# EAGLE design UIPCB (EAGLE 9.5.1)
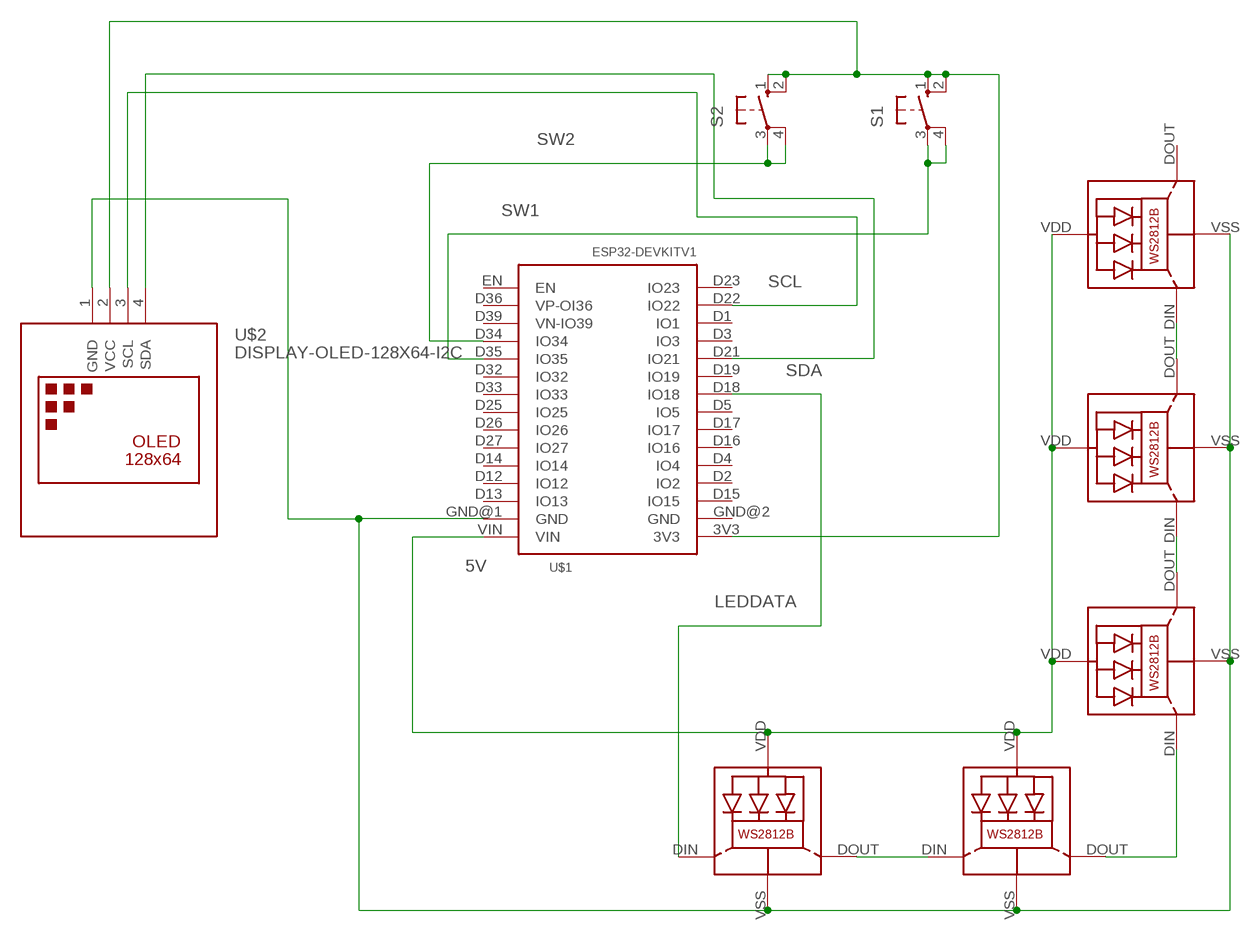
[diagram p0: schematic, sheet 1]

## Parts
LED0  WS2812B  [WS2812B]
LED1  WS2812B  [WS2812B]
LED2  WS2812B  [WS2812B]
LED3  WS2812B  [WS2812B]
LED4  WS2812B  [WS2812B]
S1  10-XX  [B3F-10XX]
S2  10-XX  [B3F-10XX]
U$1  ESP32DEVKITV1  [ESP32-DEVKITV1]
U$2  DISPLAY-OLED-128X64-I2C  [DISPLAY-OLED-128X64-I2C]

## Nets
3V3: S1.1(S) S1.2(S1) S2.1(S) S2.2(S1) U$1.3V3 U$2.2(VCC)
5V: LED0.VDD LED1.VDD LED2.VDD LED3.VDD LED4.VDD U$1.VIN
GND: LED0.VSS(GND) LED1.VSS(GND) LED2.VSS(GND) LED3.VSS(GND) LED4.VSS(GND) U$1.GND@1(GND) U$2.1(GND)
LEDDATA: LED0.DIN(DI) U$1.D18(IO18)
N$1: LED0.DOUT(DO) LED1.DIN(DI)
N$2: LED1.DOUT(DO) LED2.DIN(DI)
N$3: LED2.DOUT(DO) LED3.DIN(DI)
N$4: LED3.DOUT(DO) LED4.DIN(DI)
SCL: U$1.D22(IO22) U$2.3(SCL)
SDA: U$1.D21(IO21) U$2.4(SDA)
SW1: S1.3(P) S1.4(P1) U$1.D35(IO35)
SW2: S2.3(P) S2.4(P1) U$1.D34(IO34)
Unconnected: LED4.DOUT(DO) U$1.D1(IO1) U$1.D2(IO2) U$1.D3(IO3) U$1.D4(IO4) U$1.D5(IO5) U$1.D12(IO12) U$1.D13(IO13) U$1.D14(IO14) U$1.D15(IO15) U$1.D16(IO16) U$1.D17(IO17) U$1.D19(IO19) U$1.D23(IO23) U$1.D25(IO25) U$1.D26(IO26) U$1.D27(IO27) U$1.D32(IO32) U$1.D33(IO33) U$1.D36(VP-OI36) U$1.D39(VN-IO39) U$1.EN U$1.GND@2(GND)

## Library data of the parts
LED0 LED1-LED4 = WS2812B:WS2812B: Features and Benefits  * Intelligent reverse connect protection, the power supply reverse connection does not damage the IC. * The control circuit and the LED share the only power source. Control circuit and RGB chip are integrated in a package of 5050 components, form a complete control of pixel point.  * Built-in signal reshaping circuit, after wave reshaping to the next driver, ensure wave-form distortion not accumulate.  * Built-in electric reset circuit and power lost reset circuit.  * Each pixel of the three primary color can achieve 256 brightness display, completed 16777216 color full color display, and scan frequency not less than 400Hz/s.  * Cascading port transmission signal by single line.  * Any two point the distance more than 5m transmission signal without any increase circuit.  * When the refresh rate is 30fps, cascade number are not less than1024 points.  * Send data at speeds of 800Kbps.  *The color of the light were highly consistent, cost-effective. Applications  Full-color module, Full color soft lights a lamp strip. LED decorative lighting, Indoor/outdoor LED video irregular screen. General description WS2812B is a intelligent control LED light source that the control circuit and RGB chip are integrated in a package of 5050 components. It internal include intelligent digital port data latch and signal reshaping amplification drive circuit. Also include a precision internal oscillator and a 12V voltage programmable constant curre-nt control part, effectively ensuring the pixel point light color height consistent. The data transfer protocol use single NZR communication mode. After the pixel power-on reset, the DIN port receive data from controller, the first pixel collect initial 24bit data then sent to the internal data latch, the other data which reshaping by the internal signal reshaping amplification circuit sent to the next cascade pixel through the DO port. After transmission for each pixel,the signal to reduce 24bit. pixel adopt auto reshaping transmit technology, making the pixel cascade number is not limited the signal transmission, only depend on the speed of signal transmission. LED with low driving voltage, environmental protection and energy saving, high brightness, scattering angle is large, good consistency, low power, long life and other advantages. The control chip integrated in LED above becoming more simple circuit, small volume, convenient installation. Absolute Maximum Ratings Power supply voltage: VDD +3.5V..+5.3V Input voltage: VI -0.5V..VDD+0.5V based on WS2812 from https://github.com/adafruit/Adafruit-Eagle-Library
S1 S2 = switch-omron:10-XX: OMRON SWITCH; MPN: B3F-1000; OC_FARNELL: 176432; OC_NEWARK: 36M3542
U$1 = ESP32-DEVKITV1:ESP32DEVKITV1
U$2 = SSD1306:DISPLAY-OLED-128X64-I2C: 128x64 Dot Matrix OLED Module based on SSD1306 chip Variant with I2C interface More details available here: http://www.instructables.com/id/Monochrome-096-i2c-OLED-display-with-arduino-SSD13/ SSD1306 datasheet: https://cdn-shop.adafruit.com/datasheets/SSD1306.pdf Click here to find device on ebay.com <http://www.ebay.com/sch/oled+display+128x64+iic> Note: There are two variants: I2C and SPI. Search for the proper version.

## Board
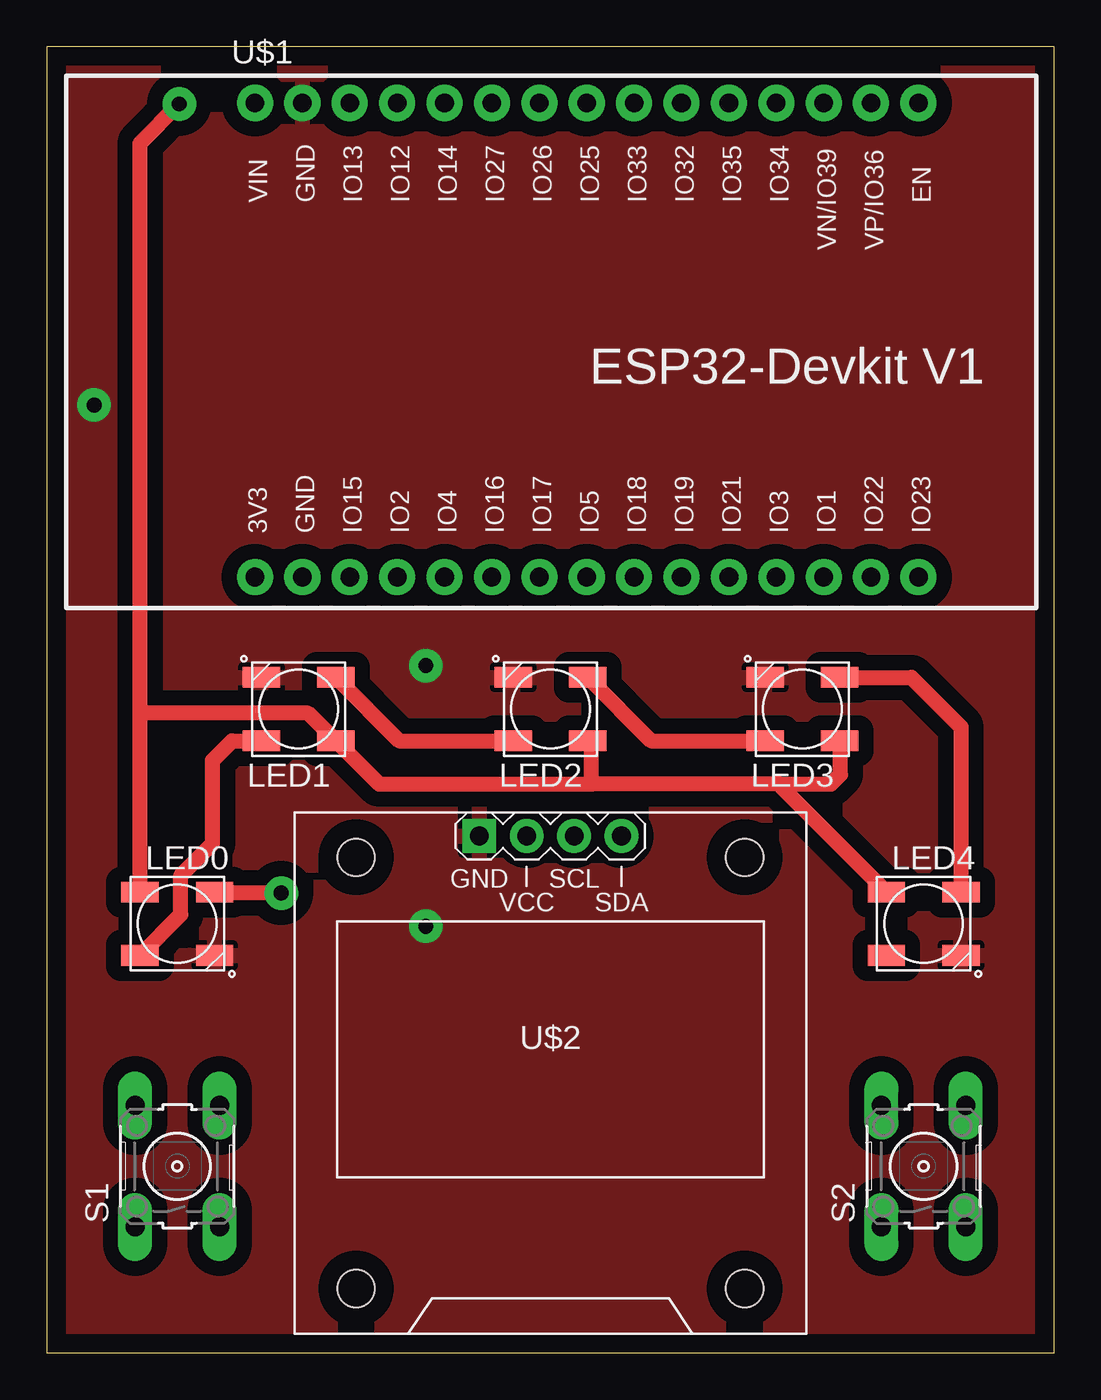
[diagram p1: board, top side]
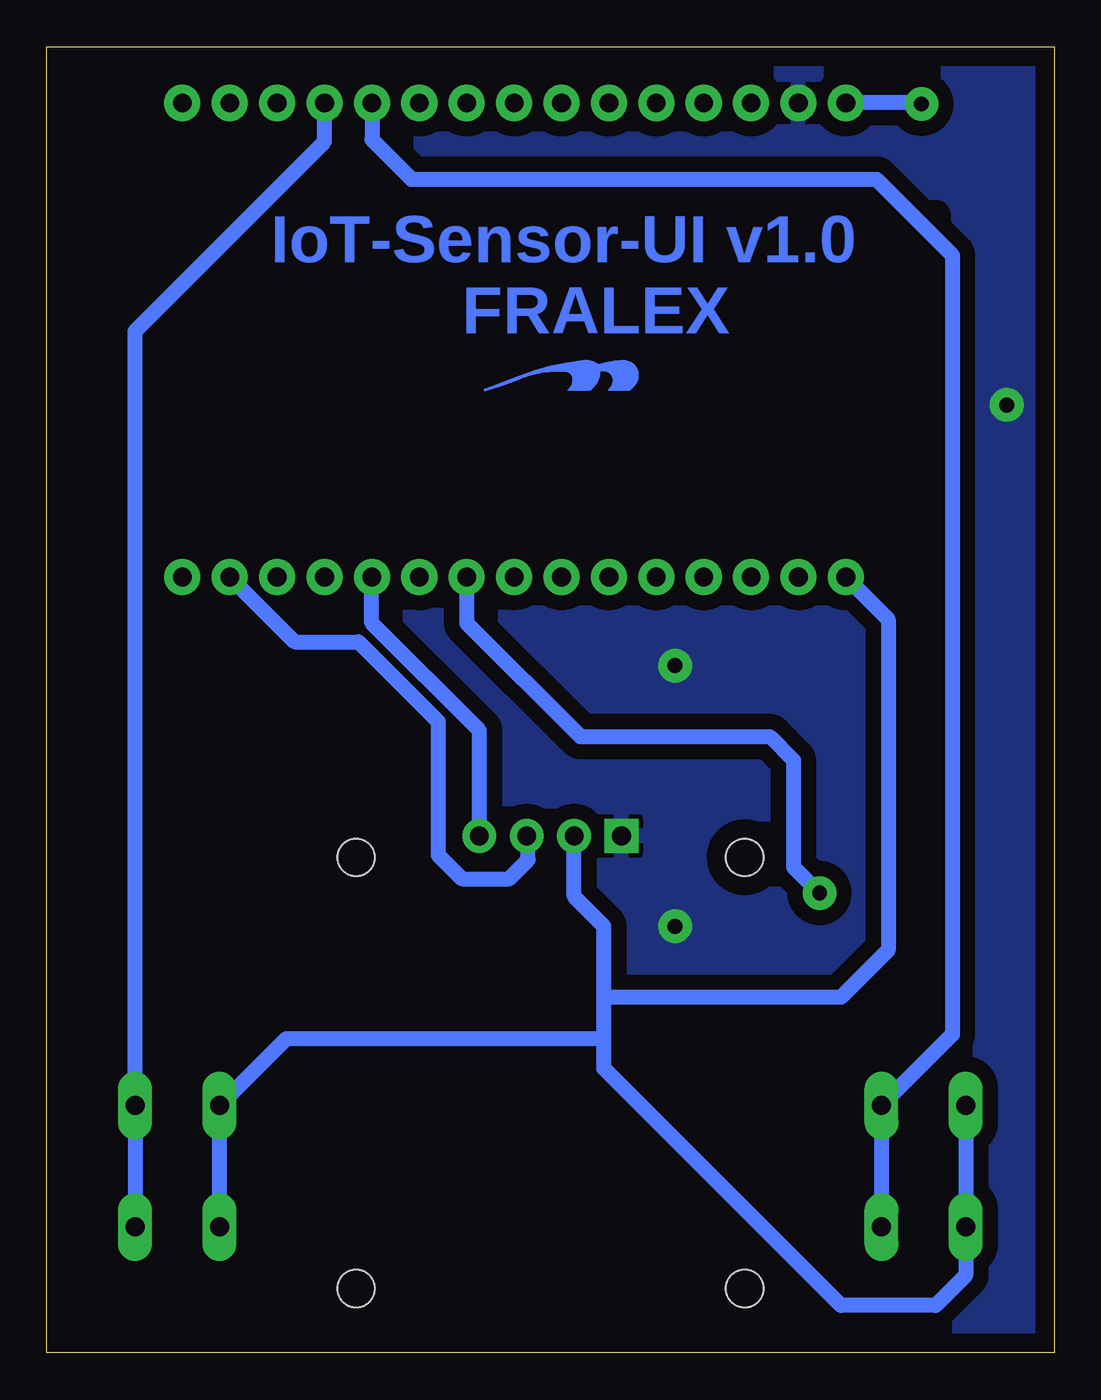
[diagram p2: board, bottom side, seen from below]

Size 54 x 70 mm. Coordinates in mm from the lower left corner, seen from the top.
Outline: 0,0 54,0 54,70 0,70 0,0
Copper layers (1*16): Top 0.035mm / dielectric 1.5mm / Bottom 0.035mm
Design rules "default": minimum track width 16mil, minimum drill 0.35mm, track to track 16mil, track to pad 16mil, pad to pad 16mil, via to via 16mil, smd to smd 6mil, copper to edge 40mil, drill to drill 6mil, minimum pad ring 16mil, minimum via ring 8mil, stop-mask expansion 4mil, vias tented up to drill 0mil, thermal gap 10mil

### Footprints (pad centres in the part's own frame; a part is rotated, then mirrored left to right if it is on the bottom)
WS2812B = smd 2 x 1.1: DIN 2,1.7; DOUT -2,-1.7; VDD -2,1.7; VSS 2,-1.7
B3F-10XX = drill 1.016 long: 1 -3.251,2.261; 2 3.251,2.261; 3 -3.251,-2.261; 4 3.251,-2.261
ESP32-DEVKITV1 = drill 1 pad 1.93: 3V3 -16.52,-12.27; D1 13.96,-12.27; D2 -8.9,-12.27; D3 11.42,-12.27; D4 -6.36,-12.27; D5 1.26,-12.27; D12 -8.9,13.135; D13 -11.44,13.135; D14 -6.36,13.135; D15 -11.44,-12.27; D16 -3.82,-12.27; D17 -1.28,-12.27; D18 3.8,-12.27; D19 6.34,-12.27; D21 8.88,-12.27; D22 16.5,-12.27; D23 19.04,-12.27; D25 1.26,13.135; D26 -1.28,13.135; D27 -3.82,13.135; D32 6.34,13.135; D33 3.8,13.135; D34 11.42,13.135; D35 8.88,13.135; D36 16.5,13.135; D39 13.96,13.135; EN 19.04,13.135; GND@1 -13.98,13.135; GND@2 -13.98,-12.27; VIN -16.52,13.135
DISPLAY-OLED-128X64-I2C = drill 1 square: 1 -3.81,12.7 | drill 1: 2 -1.27,12.7; 3 1.27,12.7; 4 3.81,12.7 | hole 2: -10.414,11.557; 10.414,11.557; 10.414,-11.557; -10.414,-11.557

### Placement (x,y rotation side)
LED0  7,23 0 top
LED1  13.5,34.5 180 top
LED2  27,34.5 180 top
LED3  40.5,34.5 180 top
LED4  47,23 0 top
S1  7,10 90 top
S2  47,10 90 top
U$1  27.69,53.85 0 top
U$2  27,15 0 top
U$4  [LOGOBOTTOM]  21.59,50.8 0 top

### Tracks (layer width: path | path; a pad name or v marks a point on that pad's centre or on a via)
3V3
  Bottom 0.813: S1.2 S1.1 4.74,4.15 6.35,2.54 11.43,2.54 24.13,15.24 24.13,16.84 | S2.1 S2.2 41.15,16.84 24.13,16.84 | 24.13,16.84 24.13,19.05 | 24.13,19.05 24.13,22.86 25.73,24.46 U$2.2 | U$1.3V3 8.89,39.3 8.89,21.59 11.43,19.05 24.13,19.05
5V  (via drill 0.8 pad 1.8)
  Top 0.813: v7.11,66.93 5,64.82 5,34.29 | LED0.VDD 5,34.29 | 5,34.29 14.01,34.29 LED1.VDD 17.82,30.48 29.21,30.48 | 29.21,30.48 29.21,32.59 LED2.VDD | 39.37,30.48 29.21,30.48 | LED4.VDD 39.37,30.33 39.37,30.48 | 39.37,30.48 42.04,30.48 42.55,30.99 42.55,32.76 LED3.VDD
  Bottom 0.813: v7.11,66.93 7.17,66.98 U$1.VIN
GND  (via drill 0.8 pad 1.8)
  other vias: 20.32,36.83 2.54,50.8 20.32,22.86
  pour Top (isolate 0.813): 0,69.85 54.61,69.85 54.61,0 0,0
  pour Bottom (isolate 0.813): 0,69.85 54.61,69.85 54.61,0 0,0
LEDDATA  (via drill 0.8 pad 1.8)
  Top 0.813: v12.57,24.64 9.06,24.64 LED0.DIN
  Bottom 0.813: U$1.D18 31.49,39.11 25.4,33.02 15.24,33.02 13.97,31.75 13.97,26.04 v12.57,24.64
N$1
  Top 0.813: LED0.DOUT 7.19,23.49 7.19,25.59 8.89,27.29 8.89,31.75 9.94,32.8 LED1.DIN
N$2
  Top 0.813: LED1.DOUT 18.9,32.8 LED2.DIN
N$3
  Top 0.813: LED2.DOUT 32.4,32.8 LED3.DIN
N$4
  Top 0.813: LED3.DOUT 46.35,36.2 49,33.55 LED4.DIN
SCL
  Bottom 0.813: U$1.D22 40.71,38.1 37.28,38.1 33.02,33.84 33.02,26.67 31.75,25.4 29.21,25.4 28.19,26.42 28.19,27.62 U$2.3
SDA
  Bottom 0.813: U$2.4 30.81,33.35 36.58,39.12 36.58,41.57 U$1.D21
SW1
  Bottom 0.813: S1.3 S1.4 5.45,17.06 5.45,58.82 9.52,62.89 34.44,62.89 36.57,65.01 U$1.D35
SW2
  Bottom 0.813: U$1.D34 39.11,64.91 49.26,54.75 S2.4 S2.3

### Text on the board
Bottom: IoT-Sensor-UI v1.0 | FRALEX